# EAGLE design DoubleSwitch (EAGLE 6.4)
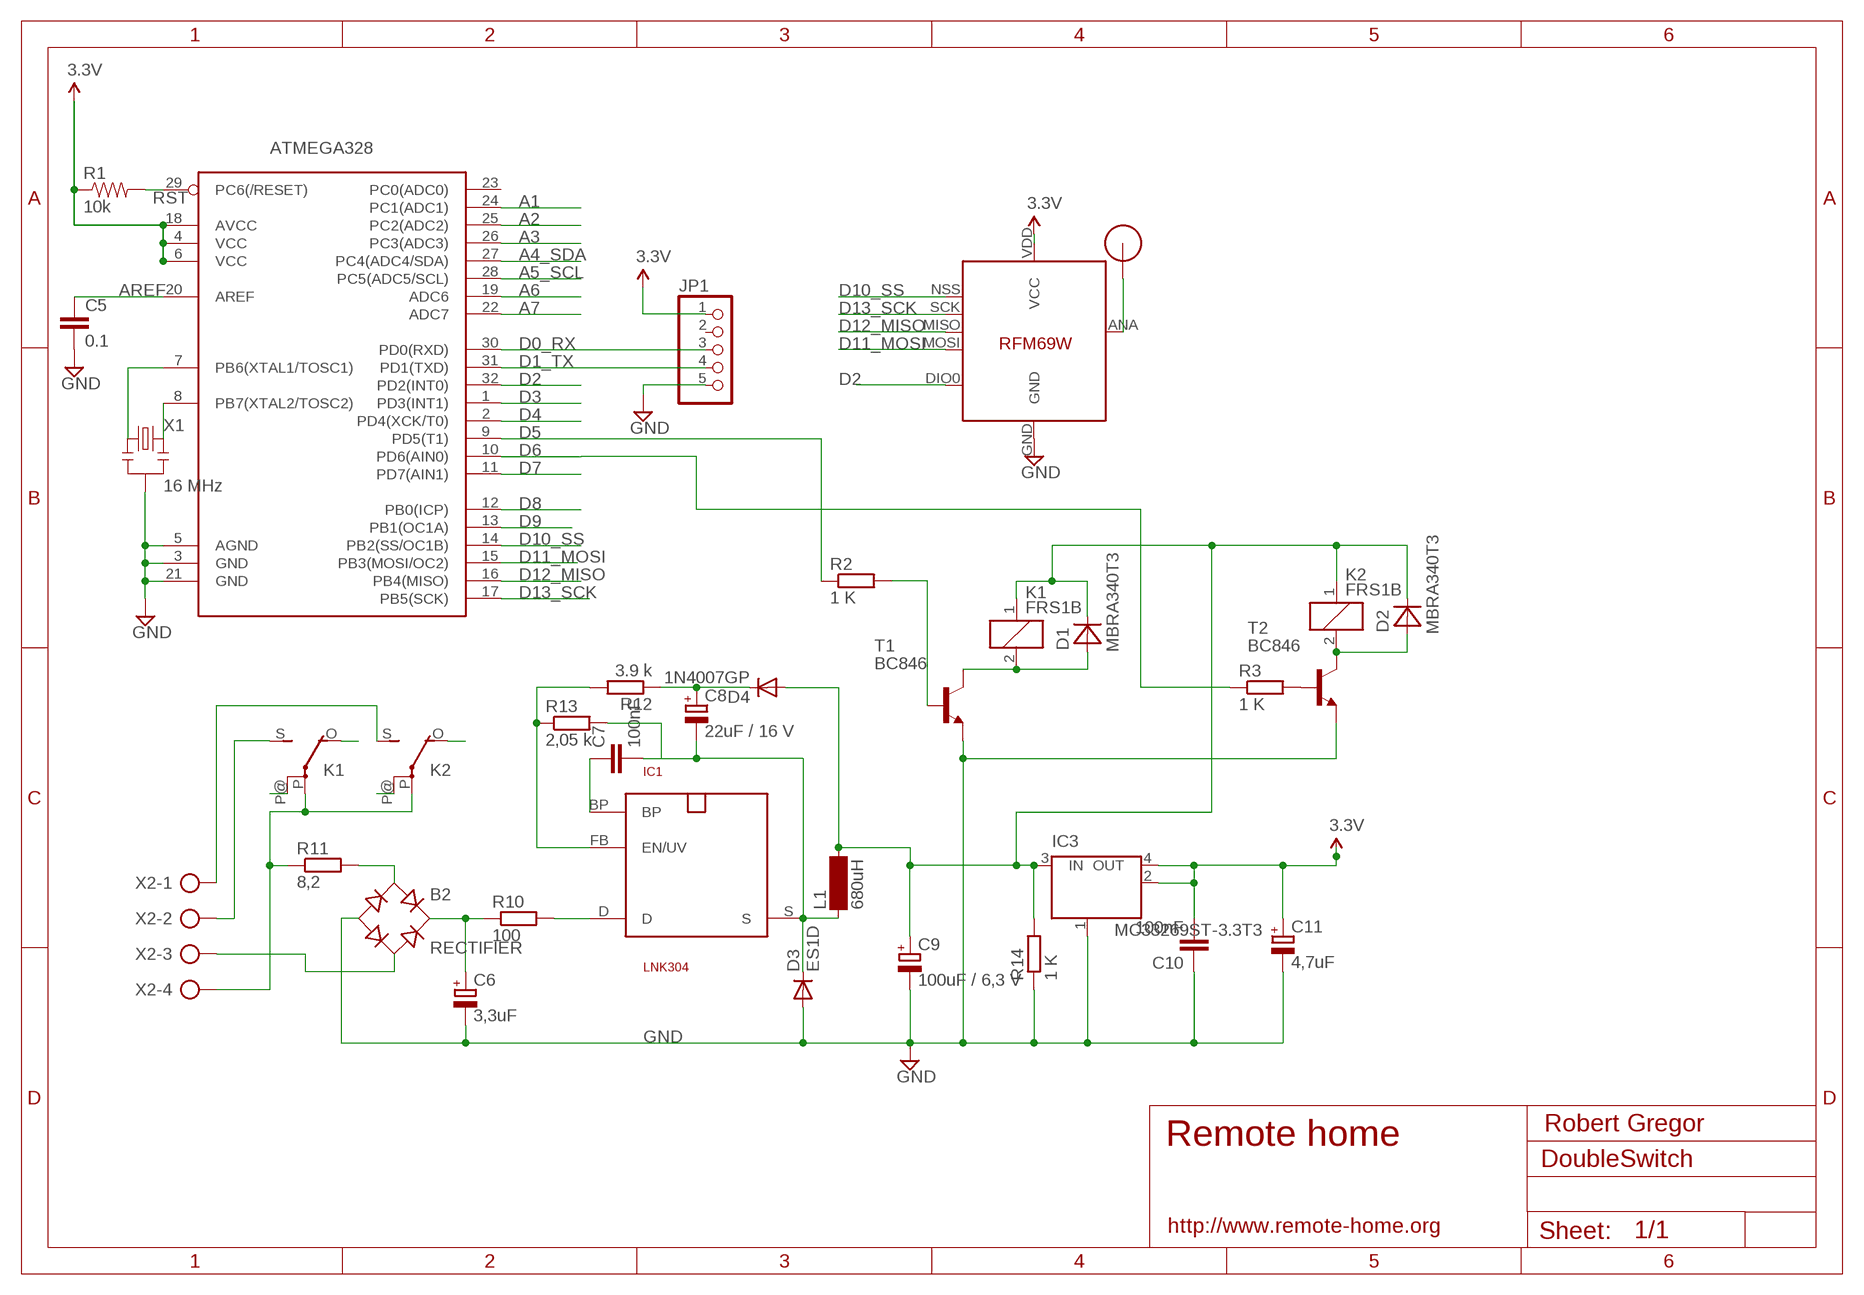
[diagram p0: schematic, sheet 1]

## Parts
ATMEGA328  ATMega-328  ATMEGA168/328TQFP32  [TQFP32-08]
B2  RECTIFIER  RECTIFIER-S40  [TO-269AA]
C5  0.1  CAP0603-CAP  [0603-CAP]
C6  3,3uF  CPOL-EUE5-10.5  [E5-10,5]
C7  100nF  C-EUC2012  [C2012]
C8  22uF / 16 V  CPOL-EUSMCC  [SMC_C]
C9  100uF / 6,3 V  CPOL-EUE2.5-5  [E2,5-5]
C10  100nF  C-EUC2012  [C2012]
C11  4,7uF  CPOL-EUSMCA  [SMC_A]
D1  MBRA340T3  [SMA]
D2  MBRA340T3  [SMA]
D3  ES1D  DIODE-DO214AC  [DO214AC]
D4  1N4007GP  DIODE-DO214AA  [DO214AA]
IC1  LNK304  SO-8C  [SO-8C]
IC3  MC33269ST-3.3T3  [SOT223]
JP1  PINHD-1X5  [1X05]
K1  FRS1B  [FRS1B]
K2  FRS1B  [FRS1B]
L1  680uH  BS11  [BS11]
R1  10k  RESISTOR0603-RES  [0603-RES]
R2  1 K  R-EU_M2012  [M2012]
R3  1 K  R-EU_M2012  [M2012]
R10  100  R-EU_R2512W  [R2512W]
R11  8,2  R-EU_0411/12  [0411/12]
R12  3.9 k  R-EU_M2012  [M2012]
R13  2,05 k  R-EU_M2012  [M2012]
R14  1 K  R-EU_M2012  [M2012]
T1  BC846  [SOT23]
T2  BC846  [SOT23]
U$1  RFM12B_ANTENNA  [RFM12B-ANTENNA]
U$5  RFM69  [RFM69W-MINPADS]
X1  16 MHz  RESONATORSMD  [RESONATOR-SMD]
X2  AK500/4  [AK500/4]

## Nets
5V: C9.+ D1.C D2.C D4.A IC3.3(IN) K1.1 K2.1 L1.2 R14.2
A0: IC1.FB(EN/UV) R12.2 R13.1
A1: ATMEGA328.24(PC1(ADC1))
A2: ATMEGA328.25(PC2(ADC2))
A3: ATMEGA328.26(PC3(ADC3))
A4_SDA: ATMEGA328.27(PC4(ADC4/SDA))
A5_SCL: ATMEGA328.28(PC5(ADC5/SCL))
A6: ATMEGA328.19(ADC6)
A7: ATMEGA328.22(ADC7)
AREF: ATMEGA328.20(AREF) C5.1
D0_RX: ATMEGA328.30(PD0(RXD)) JP1.3
D1_TX: ATMEGA328.31(PD1(TXD)) JP1.4
D2: ATMEGA328.32(PD2(INT0)) U$5.DIO0
D3: ATMEGA328.1(PD3(INT1))
D4: ATMEGA328.2(PD4(XCK/T0))
D5: ATMEGA328.9(PD5(T1)) R2.1
D6: ATMEGA328.10(PD6(AIN0)) R3.1
D7: ATMEGA328.11(PD7(AIN1))
D8: ATMEGA328.12(PB0(ICP))
D9: ATMEGA328.13(PB1(OC1A))
D10_SS: ATMEGA328.14(PB2(SS/OC1B)) U$5.NSS(SEL)
D11_MOSI: ATMEGA328.15(PB3(MOSI/OC2)) U$5.MOSI
D12_MISO: ATMEGA328.16(PB4(MISO)) U$5.MISO
D13_SCK: ATMEGA328.17(PB5(SCK)) U$5.SCK
GND [power]: ATMEGA328.3(GND) ATMEGA328.5(AGND) ATMEGA328.21(GND) B2.- C5.2 C6.- C9.- C10.1 C11.- D3.A IC3.1(GND/ADJ) JP1.5 R14.1 T1.2(E) T2.2(E) U$5.GND X1.2
N$1: ATMEGA328.7(PB6(XTAL1/TOSC1)) X1.1
N$2: R2.2 T1.1(B)
N$3: U$1.P$1 U$5.ANA(ANT)
N$4: D2.A K2.2 T2.3(C)
N$5: D1.A K1.2 T1.3(C)
N$6: R3.2 T2.1(B)
N$7 [220V]: K1.S(2:S) X2.2
N$8 [220V]: K1.P(2:P) K2.P(2:P) R11.1 X2.4
N$9 [220V]: B2.AC2 X2.3
N$10: C7.2 C8.- D3.C IC1.S L1.1 R13.2
N$11 [220V]: K1.P@(2:P)
N$12 [220V]: K2.S(2:S) X2.1
N$13 [220V]: IC1.D R10.2
N$14 [220V]: B2.+ C6.+ R10.1
N$15 [220V]: B2.AC1 R11.2
N$16 [220V]: K2.P@(2:P)
N$17 [220V]: K1.O(2:O)
N$18: C7.1 IC1.BP
N$19 [220V]: K2.O(2:O)
N$20: C8.+ D4.C R12.1
N$21: ATMEGA328.8(PB7(XTAL2/TOSC2)) X1.3
RST: ATMEGA328.29(PC6(/RESET)) R1.2
VCC: ATMEGA328.4(VCC) ATMEGA328.6(VCC) ATMEGA328.18(AVCC) C10.2 C11.+ IC3.2(OUT) IC3.4(OUT) JP1.1 R1.1 U$5.VDD(VCC) ; supply symbol labelled 3.3V
Unconnected: ATMEGA328.23(PC0(ADC0)) JP1.2

## Notes on the sheet
- Robert Gregor
- Remote home
- http://www.remote-home.org

## Library data of the parts
ATMEGA328 = LowPowerLab:ATMEGA168/328: Atmel 32-pin 8-bit micro, 16k flash.
B2 = rectifier:RECTIFIER-: Rectifier
C5 = LowPowerLab:CAP: Capacitor Standard 0603 ceramic capacitor, and 0.1" leaded capacitor.
C6 C8 C9 C11 = resistor:CPOL-EU: POLARIZED CAPACITOR, European symbol
C7 C10 = resistor:C-EU: CAPACITOR, European symbol
D1 D2 = diode:MBRA340T3: Surface Mount Schottky Power Rectifier Source: http://www.onsemi.com/pub_link/Collateral/MBRA340T3-D.PDF
D3 D4 = diode:DIODE-: DIODE
IC1 = powerint:SO-8C: 700V MOSFET für Schaltnetz-Trafos. Pin 3 fehlt. SMD
IC3 = linear:MC33269ST*: Adjustable Output Low Dropout Voltage Regulator 800 mA Source: http://www.onsemi.com/pub/Collateral/MC33269-D.PDF
JP1 = pinhead:PINHD-1X5: PIN HEADER
K1 K2 = relay:FRS1B: RELAY 1 x switch, same as V23101-D6-A201, Siemens; OC_FARNELL: unknown; OC_NEWARK: unknown
L1 = inductor-neosid:BS: INDUCTOR nominal inductance, magnetically screened; OC_FARNELL: unknown; OC_NEWARK: unknown
R1 = LowPowerLab:RESISTOR: Resistor Basic schematic elements and footprints for 0603, 1206, and PTH resistors.
R2 R3 R10-R14 = resistor:R-EU_: RESISTOR, European symbol
T1 T2 = transistor:BC846: NPN TRANSISTOR
U$1 = LowPowerLab:RFM12B_ANTENNA
U$5 = LowPowerLab:RFM69
X1 = SparkFun:RESONATOR: Resonator Small SMD resonator. This is the itty bitty 10/20MHz resonators with built in caps. CSTCE10M0G55 and CSTCE20M0V53. Footprint has been reviewed closely but hasn't been tested yet.
X2 = con-ptr500:AK500/4: CONNECTOR; OC_FARNELL: unknown; OC_NEWARK: unknown

## Net classes
1 power: width 0.381 mm, clearance 0.254 mm
2 220V: width 0.381 mm, clearance 0.508 mm

## Board
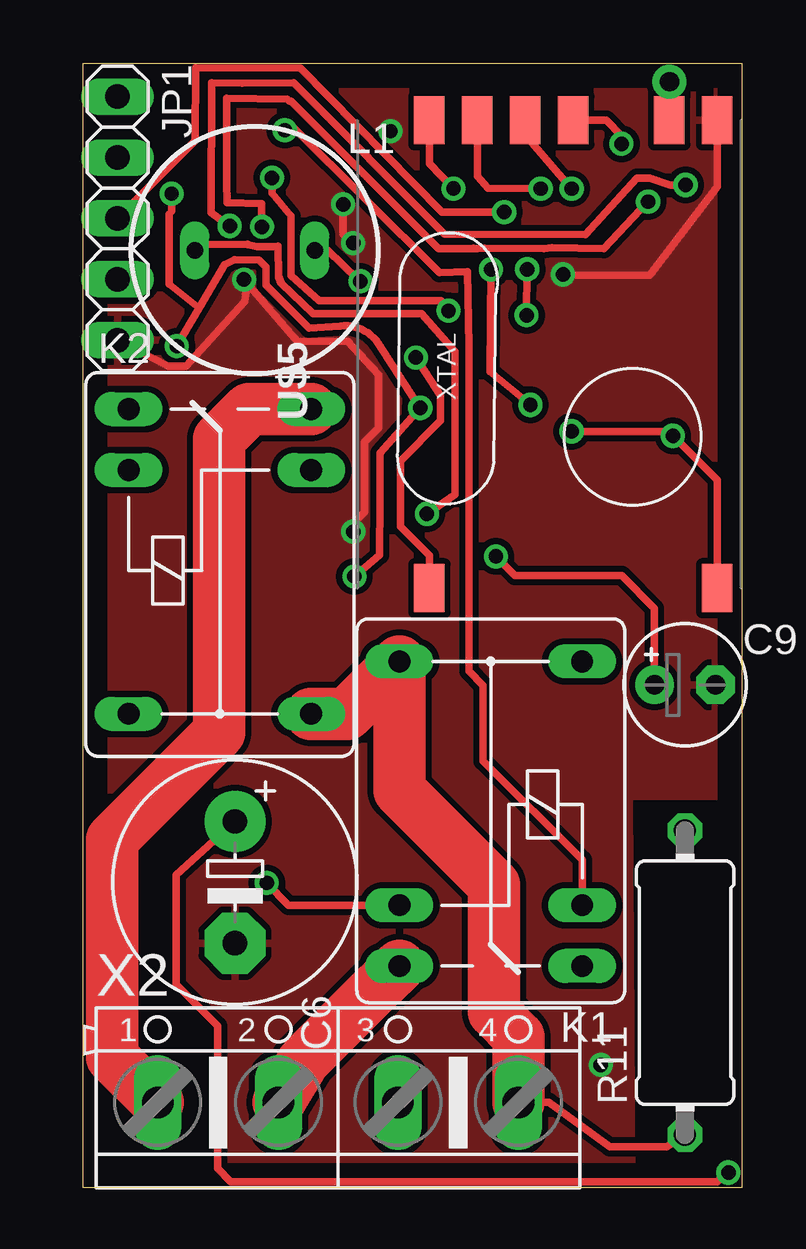
[diagram p1: board, top side]
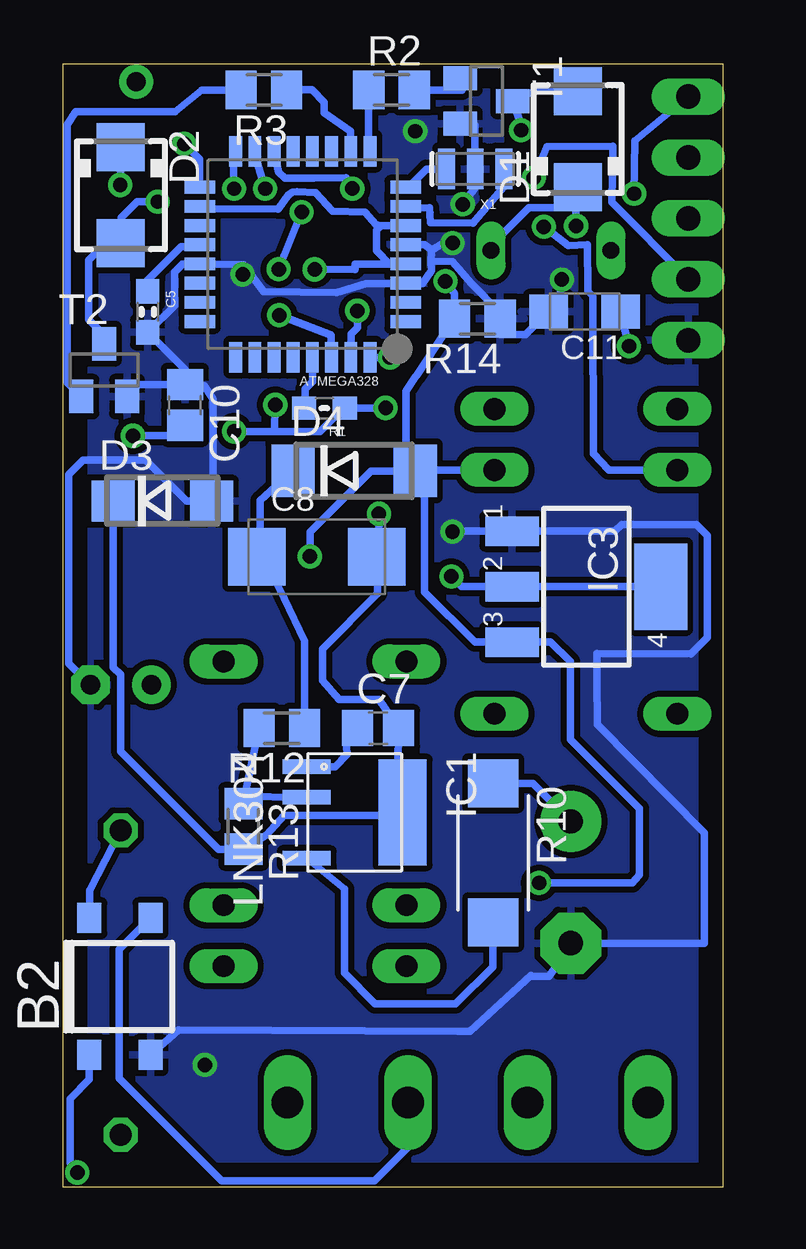
[diagram p2: board, bottom side, seen from below]

Size 27.5 x 46.83 mm. Coordinates in mm from the lower left corner, seen from the top.
Outline: 0,0 27.5,0 27.5,46.84 0,46.84 0,0
Copper layers (1*16): Top 0.035mm / dielectric 1.5mm / Bottom 0.035mm
Design rules "default": minimum track width 10mil, minimum drill 24mil, track to track 8mil, track to pad 8mil, pad to pad 8mil, via to via 8mil, smd to smd 8mil, copper to edge 40mil, drill to drill 8mil, minimum pad ring 10mil, minimum via ring 8mil, stop-mask expansion 4mil, vias tented up to drill 0mil, thermal gap 10mil

### Footprints (pad centres in the part's own frame; a part is rotated, then mirrored left to right if it is on the bottom)
TQFP32-08 = smd 1.27 x 0.533: 1 -4.293,2.8; 2 -4.293,2; 3 -4.293,1.2; 4 -4.293,0.4; 5 -4.293,-0.4; 6 -4.293,-1.2; 7 -4.293,-2; 8 -4.293,-2.8; 17 4.293,-2.8; 18 4.293,-2; 19 4.293,-1.2; 20 4.293,-0.4; 21 4.293,0.4; 22 4.293,1.2; 23 4.293,2; 24 4.293,2.8 | smd 0.533 x 1.27: 9 -2.8,-4.293; 10 -2,-4.293; 11 -1.2,-4.293; 12 -0.4,-4.293; 13 0.4,-4.293; 14 1.2,-4.293; 15 2,-4.293; 16 2.8,-4.293; 25 2.8,4.293; 26 2,4.293; 27 1.2,4.293; 28 0.4,4.293; 29 -0.4,4.293; 30 -1.2,4.293; 31 -2,4.293; 32 -2.8,4.293
TO-269AA = smd 1 x 1.25: + -1.28,-2.855; - 1.28,-2.855; AC1 -1.28,2.855; AC2 1.28,2.855
0603-CAP = smd 1.016 x 0.965: 1 -0.85,0; 2 0.85,0
E5-10,5 = drill 1.016 pad 2.54: + -2.54,0 | drill 1.016 pad 2.54 octagon: - 2.54,0
C2012 = smd 1.3 x 1.5: 1 -0.85,0; 2 0.85,0
SMC_C = smd 2.4 x 2.4: + -2.5,0; - 2.5,0
E2,5-5 = drill 0.813 pad 1.6: + -1.27,0 | drill 0.813 pad 1.6 octagon: - 1.27,0
SMC_A = smd 1.6 x 1.4: + -1.5,0; - 1.5,0
SMA = smd 2 x 2: A 2,0; C -2,0
DO214AC = smd 1.8 x 1.7: A 2.05,0; C -2.05,0
DO214AA = smd 1.8 x 2.2: A 2.55,0; C -2.55,0
SO-8C = smd 0.6 x 2: BP -1.905,-2; D 1.905,-2; FB -0.635,-2 | smd 4.41 x 2: S 0,2
SOT223 = smd 1.219 x 2.235: 1 -2.311,-3.099; 2 0,-3.099; 3 2.311,-3.099 | smd 3.6 x 2.2: 4 0,3.099
1X05 = drill 1.016 long: 1 -5.08,0; 2 -2.54,0; 3 0,0; 4 2.54,0; 5 5.08,0
FRS1B = drill 0.914 long: 1 0,3.81; 2 0,-3.81; O -2.54,-3.81; P 10.16,3.81; P@ 10.16,-3.81; S -2.54,3.81
BS11 = drill 0.7 long: 1 -2.5,0; 2 2.5,0
0603-RES = smd 1.016 x 0.965: 1 -0.85,0; 2 0.85,0
M2012 = smd 1.3 x 1.6: 1 -0.95,0; 2 0.95,0
R2512W = smd 2 x 2.1: 1 -2.896,0; 2 2.896,0
0411/12 = drill 0.914 octagon: 1 -6.35,0; 2 6.35,0
SOT23 = smd 1 x 1.4: 1 -0.95,-1.1; 2 0.95,-1.1; 3 0,1.1
RFM12B-ANTENNA = drill 0.8 pad 1.422: P$1 0,0
RFM69W-MINPADS = smd 2 x 1.27: ANA 8,-5; DIO0 -11.5,5; GND 8,-7; MISO 8,1; MOSI 8,3; NSS 8,5; SCK 8,-1; VDD -11.5,-7
RESONATOR-SMD = smd 0.7 x 1.7: 1 -1.2,0; 2 0,0; 3 1.2,0
AK500/4 = drill 1.321 long: 1 -7.518,0; 2 -2.489,0; 3 2.489,0; 4 7.518,0

### Placement (x,y rotation side)
ATMEGA328  17.52,38.88 180 bottom
B2  25.14,8.36 0 bottom
C5  23.99,36.48 270 bottom
C6  6.34,12.7 270 top
C7  14.38,19.13 0 bottom
C8  16.93,26.27 0 bottom
C9  25.1,20.94 0 top
C10  22.43,32.6 270 bottom
C11  5.77,36.49 180 bottom
D1  6.06,43.68 90 bottom
D2  25.1,41.34 270 bottom
D3  23.37,28.6 0 bottom
D4  15.38,29.86 0 bottom
IC1  15.35,15.62 270 bottom
IC3  5.69,25.03 270 bottom
JP1  1.44,40.38 270 top
K1  17.01,11.75 90 top
K2  5.71,29.89 270 top
L1  7.17,39.05 0 top
R1  16.61,32.47 180 bottom
R2  13.82,45.73 0 bottom
R3  19.14,45.73 180 bottom
R10  9.58,13.94 270 bottom
R11  25.11,8.52 90 top
R12  18.39,19.14 180 bottom
R13  19.98,15.03 270 bottom
R14  10.24,36.2 180 bottom
T1  9.86,45.27 270 bottom
T2  25.8,34.05 0 bottom
U$1  24.46,46.07 0 top
U$5  19.45,36.46 90 top
X1  10.33,42.44 180 bottom
X2  10.64,3.53 0 top

### Tracks (layer width: path | path; a pad name or v marks a point on that pad's centre or on a via)
5V  (via drill 0.6)
  Top 0.305: K1.1 8.57,11.75 v7.67,12.68 | v11.57,37.76 11.44,37.85 10.19,39.05 L1.2 | C9.+ 23.83,24.13 22.47,25.49 18.02,25.49 v17.22,26.29 | v25.13,41.77 24.48,41.77 23.64,42.06 23.11,42.06 20.96,39.69 15.07,39.73 8.78,46.03 6.65,46.02 5.36,46.03 5.34,40.61 v6.12,40.06
  Bottom 0.305: D4.A 12.43,28.74 12.43,24.8 10.34,22.72 IC3.3 7.19,22.73 6.37,21.9 6.37,18.67 3.48,15.79 3.48,13.01 3.77,12.68 v7.67,12.68 | K2.1 12.9,29.89 D4.A | v7.67,12.68 7.68,12.66 v7.67,12.68 | v11.57,37.76 11.19,37.24 R14.2 11.21,36.2 12.77,33.85 12.81,33.79 13.22,33.18 13.22,29.58 D4.A | v17.22,26.29 17.22,27.3 15.46,29.07 | 15.46,29.07 | 15.46,29.07 14.66,29.86 D4.A | D2.C 25.1,41.8 v25.13,41.77 | v6.12,40.06 6.12,40.87 | 6.12,40.87 D1.C | L1.2 9.67,39.25 8.1,40.82 6.17,40.82 6.12,40.87
A0
  Bottom 0.305: IC1.FB 18.18,16.25 19.44,16.28 19.69,16.28 R13.1 20,16 R12.2
AREF
  Bottom 0.305: C5.1 24,37.33 24.01,37.34 24.01,37.78 23.41,38.38 | 23.41,38.38 | 23.41,38.38 22.58,39.21 21.88,39.21 ATMEGA328.20
D0_RX  (via drill 0.6)
  Top 0.305: v17.57,40.64 14.98,40.64 9.08,46.63 4.71,46.65 4.68,43.61 JP1.3 | v18.52,38.26 v18.5,36.34
  Bottom 0.305: v17.57,40.64 v18.52,38.26 | v18.5,36.34 16.34,35.52 ATMEGA328.30
D1_TX  (via drill 0.6)
  Top 0.305: v7.88,42.07 7.88,41.43 8.69,40.47 8.69,38 9.85,36.95 14.94,36.95 v15.24,36.53
  Bottom 0.305: v7.88,42.07 7.33,43.37 4.6,43.39 4.62,41.06 JP1.4 | v15.24,36.53 15.24,35.82 15.51,35.56 15.51,34.6 ATMEGA328.31
D2  (via drill 0.6)
  Top 0.305: U$5.DIO0 14.45,26.34 13.24,27.54 13.24,30.27 14.92,31.95 14.92,33 v13.88,34.58
  Bottom 0.305: v13.88,34.58 14.71,34.58 ATMEGA328.32
D5
  Bottom 0.305: R2.1 14.77,43.22 ATMEGA328.9
D6
  Bottom 0.305: ATMEGA328.10 15.52,44.02 16.63,44.78 16.63,45.23 17.14,45.74 18.18,45.74 R3.1
D10_SS  (via drill 0.6)
  Top 0.305: U$5.NSS 14.45,42.66 v15.45,41.62
  Bottom 0.305: v15.45,41.62 15.71,42.07 17.07,42.05 18.25,42.05 18.52,42.3 18.7,43.16 ATMEGA328.14
D11_MOSI  (via drill 0.6)
  Top 0.305: U$5.MOSI 16.45,42.13 16.9,41.65 v19.09,41.62
  Bottom 0.305: v19.09,41.62 19.54,43.15 ATMEGA328.15
D12_MISO  (via drill 0.6)
  Top 0.305: U$5.MISO 18.45,43.85 v20.38,41.62
  Bottom 0.305: v20.38,41.62 20.42,43 ATMEGA328.16
D13_SCK  (via drill 0.6)
  Top 0.305: v22.46,43.49 22.46,43.84 21.82,44.47 U$5.SCK
  Bottom 0.305: ATMEGA328.17 21.81,42.84 v22.46,43.49
GND  (via drill 0.6)
  Top 0.305: U$5.GND 26.45,41.71 23.64,38.02 20,38.02 v20.02,38.04 | v11.28,27.32 11.28,27.67 11.75,28.14 11.75,31.06 12.32,31.63 12.32,33.86 11.04,35.27 8.95,35.24 v6.72,37.83 | v10.85,40.97 10.84,39.73 v11.27,39.35 | JP1.5 3.56,34.22 4.31,34.22 6.74,36.91 6.8,37.33
  Bottom 0.305: B2.- 22.69,6.55 11.04,6.5 10.55,6.49 8,8.82 7.99,8.79 7.26,8.79 6.34,10.01 C6.- 0.77,10.16 0.77,14.76 5.23,19.29 5.26,21.18 5.26,22.25 1.33,22.22 0.65,22.9 0.65,27.16 1.1,27.62 4.22,27.62 4.5,27.34 IC3.1 11.26,27.34 v11.28,27.32 | T1.2 10.33,44.26 X1.2 10.33,41.65 v10.85,40.97 | C10.1 22.43,34.07 C5.2 22.87,36.75 22.87,38.13 22.52,38.48 ATMEGA328.21 19.99,38.44 | C10.1 24.35,33.45 T2.2 | C10.1 22.39,33.41 21.63,33.41 21.26,32.85 21.26,29 D3.A 22.37,28.6 24.07,30.3 26.67,30.3 27.27,29.7 27.27,21.84 C9.- | 19.99,38.44 19.14,37.33 16.11,37.28 14.87,37.67 13.99,37.66 13.24,37.66 ATMEGA328.3 13.21,37.66 12.53,37.66 12.15,38.21 12.18,38.59 | ATMEGA328.5 12.45,39.28 12.12,39.06 | 12.12,39.06 12.15,38.99 12.18,38.59 | 10.49,37.66 9.29,36.46 R14.1 9.29,35.54 9.28,35.53 8.23,35.53 C11.- 6.81,36.84 v6.72,37.83 | 10.49,37.66 | 10.49,37.66 11.28,38.58 12.18,38.59 | v20.02,38.04 20.02,38.09 19.99,38.44 | v11.27,39.35 11.68,39.35 12.12,39.06
  other vias: 21.6,5.09 12.83,44.01
  pour Top: 27.28,46.67 0.25,46.67 0.2,46.62 0.2,0.22 22.88,0.2 22.79,16.27 27.32,16.27 27.32,16.34 27.34,46.63 27.28,46.69
  pour Bottom: 27.27,46.65 0.2,46.65 0.2,0.2 27.34,0.2 27.34,46.72 27.27,46.72
N$1
  Bottom 0.305: ATMEGA328.7 13.22,40.84 13.18,40.79 12.23,40.82 12.18,40.19 10.41,40.18 9.12,41.71 X1.1
N$2
  Bottom 0.305: R2.2 10.88,45.73 T1.1
N$3
  Top 0.305: U$5.ANA 24.45,46.06 U$1.P$1
N$4  (via drill 0.6)
  Top 0.305: v7.47,40.03 7.45,41 6.02,41.03 6,41.9 5.99,45.38 8.52,45.36 8.62,45.26 8.68,45.26 14.82,39.12 16.44,39.12 16.28,39.14 16.43,39.12 16.74,39.14 19.22,39.12 19.56,39.16 21.72,39.12 v23.57,41.08
  Bottom 0.305: T2.3 25.8,35.51 26.45,36.16 26.45,38.64 25.75,39.33 D2.A 25.09,39.35 25.09,40.41 24.42,41.08 v23.57,41.08 | K2.2 4.75,29.89 5.4,30.59 5.42,37.11 5.64,37.37 5.64,37.43 5.66,39.28 6.45,39.25 v7.47,40.03
N$5  (via drill 0.6)
  Top 0.305: K1.2 20.82,13.63 16.69,17.76 16.69,20.91 16.1,21.51 16.1,35.06 16.04,38.15 14.87,38.12 8.74,44.21 8.53,44.13 v8.42,44.06
  Bottom 0.305: v8.42,44.06 8.45,44.35 T1.3 7.73,45.73 D1.A
N$6
  Bottom 0.305: R3.2 21.74,45.73 22.84,44.82 26.99,44.82 27.34,44.28 27.34,33.54 T2.1
N$7
  Top 2.184: X2.2 9.2,5.26 12.12,8.18 13.08,9.1 K1.S
N$8
  Top 0.305: X2.4 19.44,3.53 21.98,1.67 24.34,1.67 R11.1
  Top 2.184: X2.4 18.16,6.27 17.13,7.3 17.13,12.6 13.2,16.54 K1.P 11.02,19.73 K2.P
N$9
  Bottom 0.305: X2.3 13.13,1.66 14.52,0.27 20.91,0.27 25.17,4.53 25.17,9.9 B2.AC2
N$10  (via drill 0.6)
  Top 0.305: L1.1 4.9,39.28 5.12,39.28 6.86,39.3 6.87,39.29 7.26,39.2 8,39.2 8.14,39.21 8.15,37.96 8.26,37.69 9.6,36.41 14.12,36.41 15.52,34.83 15.52,28.87 v14.34,28.06
  Bottom 0.305: v14.34,28.06 14.38,25.86 C8.- 14.39,24.74 16.69,22.44 16.69,21.11 16,20.32 14.33,20.32 C7.2 13.56,15.83 IC1.S 13.48,15.49 18.3,15.49 19.03,14.68 R13.2 20,14.07 21.03,14.07 25.12,18.16 25.12,21.36 25.42,21.67 D3.C
N$12
  Top 2.184: K2.S 6.93,32.43 5.68,31.18 5.68,18.95 1.23,14.5 1.23,5.42 X2.1
N$13
  Bottom 0.305: R10.2 9.58,9.19 11.15,7.64 14.49,7.64 15.77,8.93 15.77,12.44 IC1.D
N$14  (via drill 0.6)
  Top 0.305: v26.92,0.61 27.03,0.8 26.46,0.23 6.16,0.23 5.61,0.78 5.61,6.72 3.9,8.46 3.9,13.02 C6.+
  Bottom 0.305: R10.1 7.93,16.83 C6.+ | B2.+ 26.42,4.49 27.22,3.69 27.22,0.99 v26.92,0.61
N$15
  Bottom 0.305: B2.AC1 26.42,11.19 26.41,11.18 26.41,12.36 R11.2
N$18
  Bottom 0.305: C7.1 15.74,19.14 15.66,18.02 16.16,17.52 IC1.BP
N$20
  Bottom 0.305: R12.1 17.44,22.77 18.29,24.55 18.93,25.85 C8.+ 19.39,25.89 19.29,25.99 19.29,28.61 D4.C
N$21
  Bottom 0.305: ATMEGA328.8 13.11,41.68 12.35,42.44 X1.3 | X1.3
RST
  Bottom 0.305: ATMEGA328.29 17.12,33.57 17.42,33.27 17.42,32.51 R1.2
VCC  (via drill 0.6)
  Top 0.305: v11.32,25.45 12.37,26.36 12.38,28.65 12.38,30.6 v14.06,32.48 12.3,35.19 arc61 10.74,35.9 9.44,35.8 7.63,37.6 7.63,38.35 7.35,38.64 6.33,38.66 5.92,38.45 4.85,36.63 | U$5.VDD 26.45,29.47 v24.6,31.32 24.42,31.5 v20.38,31.5 | v17.02,38.26 16.98,33.99 v18.66,32.61 | 4.85,36.63 v3.92,35.05 | v3.7,41.41 3.7,40.67 3.59,40.56 3.59,37.64 4.85,36.63
  Bottom 0.305: IC3.4 IC3.2 10.9,25.03 v11.32,25.45 | ATMEGA328.6 14.26,40.08 | 14.26,40.08 14.45,40.12 14.92,40.63 16.29,40.67 16.99,41.46 17.76,41.49 17.94,41.47 18.11,41.36 18.55,40.77 21.79,40.78 ATMEGA328.18 | 14.26,40.08 14.45,39.89 14.45,39.03 13.89,38.48 ATMEGA328.4 15.33,38.48 15.33,38.25 v17.02,38.26 | v14.06,32.48 R1.1 15.82,32.47 16.79,31.5 18.69,31.5 | v24.6,31.32 22.86,31.32 C10.2 | 18.69,31.5 v20.38,31.5 | v18.66,32.61 18.69,31.5 | v3.92,35.05 C11.+ | JP1.1 3.68,43.61 v3.7,41.41